# EAGLE board I2CRJ45X32 (EAGLE 9.6.2)
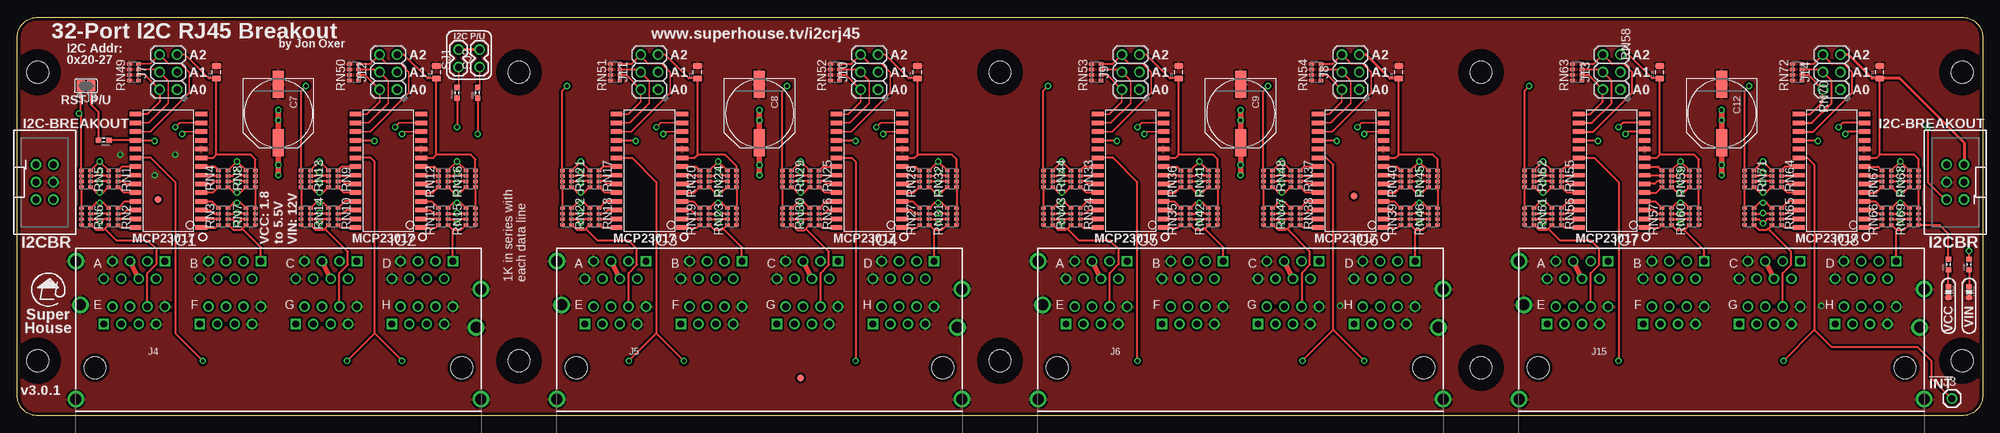
[diagram p10: board, top side]
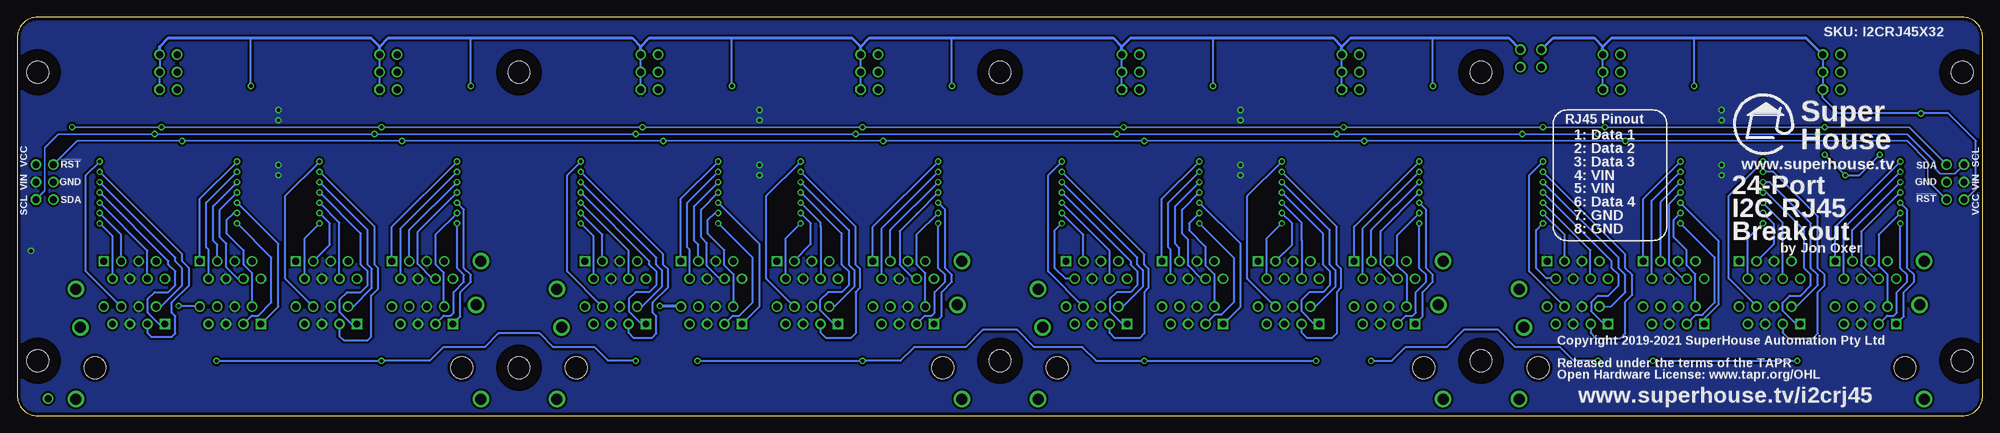
[diagram p11: board, bottom side, seen from below]

Size 286 x 58 mm. Coordinates in mm from the lower left corner, seen from the top.
Outline: 3,0 arc-90 0,3 0,55 arc-90 3,58 283,58 arc-90 286,55 286,3 arc-90 283,0 3,0
Copper layers (1*16): Top 0.035mm / dielectric 1.5mm / Bottom 0.035mm
Design rules "default *": minimum track width 10mil, minimum drill 0.5mm, track to track 12mil, track to pad 12mil, pad to pad 12mil, via to via 12mil, smd to smd 8mil, copper to edge 18mil, drill to drill 8mil, minimum pad ring 10mil, minimum via ring 8mil, stop-mask expansion 4mil, vias tented up to drill 25mil, thermal gap 10mil
Holes 3.2 mm at 143,8 143,50 73,8 73,50 3,8 283,8 213,50 3,50 213,7 283,50
tRestrict: area 69.8,4.8 to 76.2,11.2; area 139.8,4.8 to 146.2,11.2; area 139.8,46.8 to 146.2,53.2; area 69.8,46.8 to 76.2,53.2; area -0.2,4.8 to 6.2,11.2; area 279.8,4.8 to 286.2,11.2; area 279.8,46.8 to 286.2,53.2; area -0.2,46.8 to 6.2,53.2; area 209.8,3.8 to 216.2,10.2; area 209.8,46.8 to 216.2,53.2
bRestrict: area 69.8,46.8 to 76.2,53.2; area 139.8,46.8 to 146.2,53.2; area 69.8,4.8 to 76.2,11.2; area 139.8,4.8 to 146.2,11.2; area -0.2,4.8 to 6.2,11.2; area 279.8,4.8 to 286.2,11.2; area 279.8,46.8 to 286.2,53.2; area -0.2,46.8 to 6.2,53.2; area 209.8,3.8 to 216.2,10.2; area 209.8,46.8 to 216.2,53.2

## Footprints (pad centres in the part's own frame; a part is rotated, then mirrored left to right if it is on the bottom)
C0805 = smd 0.8 x 1.2: 1 -0.9,0; 2 0.9,0
PANASONIC_G = smd 3.9 x 1.6: + 4.25,0; - -4.25,0
FIDUCIAL-1X2.5 = smd 1 x 1: 1 0,0
SO28W = smd 0.65 x 1.7: 1 -7.62,-4.78; 2 -6.35,-4.78; 3 -5.08,-4.78; 4 -3.81,-4.78; 5 -2.54,-4.78; 6 -1.27,-4.78; 7 0,-4.78; 8 1.27,-4.78; 9 2.54,-4.78; 10 3.81,-4.78; 11 5.08,-4.78; 12 6.35,-4.78; 13 7.62,-4.78; 14 8.89,-4.78; 15 8.89,4.78; 16 7.62,4.78; 17 6.35,4.78; 18 5.08,4.78; 19 3.81,4.78; 20 2.54,4.78; 21 1.27,4.78; 22 0,4.78; 23 -1.27,4.78; 24 -2.54,4.78; 25 -3.81,4.78; 26 -5.08,4.78; 27 -6.35,4.78; 28 -7.62,4.78
2X3-2.54-SHROUDED = drill 1 octagon: 1 -2.54,-1.27 | drill 1: 2 -2.54,1.27; 3 0,-1.27; 4 0,1.27; 5 2.54,-1.27; 6 2.54,1.27
1X01 = drill 1.016: 1 0,0
RJ45-2X4 = drill 1 square: A1 -16.51,15.49; B1 -2.54,15.49; C1 11.43,15.49; D1 25.4,15.49; E1 -25.4,6.35; F1 -11.43,6.35; G1 2.54,6.35; H1 16.51,6.35 | drill 1: A2 -17.78,12.95; A3 -19.05,15.49; A4 -20.32,12.95; A5 -21.59,15.49; A6 -22.86,12.95; A7 -24.13,15.49; A8 -25.4,12.95; B2 -3.81,12.95; B3 -5.08,15.49; B4 -6.35,12.95; B5 -7.62,15.49; B6 -8.89,12.95; B7 -10.16,15.49; B8 -11.43,12.95; C2 10.16,12.95; C3 8.89,15.49; C4 7.62,12.95; C5 6.35,15.49; C6 5.08,12.95; C7 3.81,15.49; C8 2.54,12.95; D2 24.13,12.95; D3 22.86,15.49; D4 21.59,12.95; D5 20.32,15.49; D6 19.05,12.95; D7 17.78,15.49; D8 16.51,12.95; E2 -24.13,8.89; E3 -22.86,6.35; E4 -21.59,8.89; E5 -20.32,6.35; E6 -19.05,8.89; E7 -17.78,6.35; E8 -16.51,8.89; F2 -10.16,8.89; F3 -8.89,6.35; F4 -7.62,8.89; F5 -6.35,6.35; F6 -5.08,8.89; F7 -3.81,6.35; F8 -2.54,8.89; G2 3.81,8.89; G3 5.08,6.35; G4 6.35,8.89; G5 7.62,6.35; G6 8.89,8.89; G7 10.16,6.35; G8 11.43,8.89; H2 17.78,8.89; H3 19.05,6.35; H4 20.32,8.89; H5 21.59,6.35; H6 22.86,8.89; H7 24.13,6.35; H8 25.4,8.89 | drill 1.6: GND0 29.464,-4.572; GND1 28.79,5.85; GND2 -29.46,15.5; GND3 -28.79,9.15; GND4 -29.464,-4.572; GND5 29.46,11.43 | hole 3.2: 26.67,0; -26.67,0
2X03-P = drill 1.016 octagon: 1 -2.54,-1.27 | drill 1.016: 2 -2.54,1.27; 3 0,-1.27; 4 0,1.27; 5 2.54,-1.27; 6 2.54,1.27
LED-0603 = smd 0.762 x 0.762: A -0.762,0; C 0.762,0
R0603 = smd 0.762 x 0.762: 1 -0.762,0; 2 0.762,0
CAY16 = smd 0.5 x 0.65: 1 -1.2,-0.675; 2 -0.4,-0.675; 3 0.4,-0.675; 4 1.2,-0.675; 5 1.2,0.675; 6 0.4,0.675; 7 -0.4,0.675; 8 -1.2,0.675
1X02-P = drill 1.016: 1 -1.27,0; 2 1.27,0
SJ = smd 1.168 x 1.6: 1 -0.762,0; 2 0.762,0

## Placement (x,y rotation side)
C1  10uF  [C0805]  29,50 90 top
C2  10uF  [C0805]  61,50 90 top
C3  10uF  [C0805]  99,50 90 top
C4  10uF  [C0805]  131,50 90 top
C5  10uF  [C0805]  169,50 90 top
C6  10uF  [C0805]  201,50 90 top
C7  330uF 50V  [PANASONIC_G]  38,44 270 top
C8  330uF 50V  [PANASONIC_G]  108,44 270 top
C9  330uF 50V  [PANASONIC_G]  178,44 270 top
C10  10uF  [C0805]  239,50 90 top
C11  10uF  [C0805]  271,50 90 top
C12  330uF 50V  [PANASONIC_G]  248,44 270 top
FID1  FIDUCIAL1X2.5  [FIDUCIAL-1X2.5]  20.5,31.5 0 top
FID2  FIDUCIAL1X2.5  [FIDUCIAL-1X2.5]  194.5,32 0 top
FID3  FIDUCIAL1X2.5  [FIDUCIAL-1X2.5]  114,5.5 0 top
IC1  MCP23017SO  [SO28W]  22,35 90 top
IC2  MCP23017SO  [SO28W]  54,35 90 top
IC3  MCP23017SO  [SO28W]  92,35 90 top
IC4  MCP23017SO  [SO28W]  124,35 90 top
IC5  MCP23017SO  [SO28W]  162,35 90 top
IC6  MCP23017SO  [SO28W]  194,35 90 top
IC7  MCP23017SO  [SO28W]  232,35 90 top
IC8  MCP23017SO  [SO28W]  264,35 90 top
J1  I2C-BREAKOUT  [2X3-2.54-SHROUDED]  4,34 270 top
J2  I2C-BREAKOUT  [2X3-2.54-SHROUDED]  282,34 90 top
J3  M01-PLAIN  [1X01]  281.5,2.5 0 top
J4  RJ45-X8  [RJ45-2X4]  38,7 0 top
J5  RJ45-X8  [RJ45-2X4]  108,7 0 top
J6  RJ45-X8  [RJ45-2X4]  178,7 0 top
J7  I2C Addr 1  [2X03-P]  22,50 90 top
J8  I2C Addr 6  [2X03-P]  194,50 90 top
J9  I2C Addr 5  [2X03-P]  162,50 90 top
J10  I2C Addr 4  [2X03-P]  124,50 90 top
J11  I2C Addr 3  [2X03-P]  92,50 90 top
J12  I2C Addr 2  [2X03-P]  54,50 90 top
J13  I2C Addr 6  [2X03-P]  232,50 90 top
J14  I2C Addr 6  [2X03-P]  264,50 90 top
J15  RJ45-X8  [RJ45-2X4]  248,7 0 top
LED1  GREEN  [LED-0603]  284,18 270 top
LED2  BLUE  [LED-0603]  281,18 270 top
R97  4K7  [R0603]  281,22 90 top
R98  4K7  [R0603]  284,22 90 top
R99  4K7  [R0603]  67,47 90 top
R100  4K7  [R0603]  64,47 90 top
R101  10K  [R0603]  12.6,40.1 180 top
RN1  1K  [CAY16]  14,34.5 90 top
RN2  1K  [CAY16]  14,29 90 top
RN3  1K  [CAY16]  30,29 270 top
RN4  1K  [CAY16]  30,34.5 270 top
RN5  10K  [CAY16]  10,34.5 90 top
RN6  10K  [CAY16]  10,29 90 top
RN7  10K  [CAY16]  34,29 270 top
RN8  10K  [CAY16]  34,34.5 270 top
RN9  1K  [CAY16]  46,34.5 90 top
RN10  1K  [CAY16]  46,29 90 top
RN11  1K  [CAY16]  62,29 270 top
RN12  1K  [CAY16]  62,34.5 270 top
RN13  10K  [CAY16]  42,34.5 90 top
RN14  10K  [CAY16]  42,29 90 top
RN15  10K  [CAY16]  66,29 270 top
RN16  10K  [CAY16]  66,34.5 270 top
RN17  1K  [CAY16]  84,34.5 90 top
RN18  1K  [CAY16]  84,29 90 top
RN19  1K  [CAY16]  100,29 270 top
RN20  1K  [CAY16]  100,34.5 270 top
RN21  10K  [CAY16]  80,34.5 90 top
RN22  10K  [CAY16]  80,29 90 top
RN23  10K  [CAY16]  104,29 270 top
RN24  10K  [CAY16]  104,34.5 270 top
RN25  1K  [CAY16]  116,34.5 90 top
RN26  1K  [CAY16]  116,29 90 top
RN27  1K  [CAY16]  132,29 270 top
RN28  1K  [CAY16]  132,34.5 270 top
RN29  10K  [CAY16]  112,34.5 90 top
RN30  10K  [CAY16]  112,29 90 top
RN31  10K  [CAY16]  136,29 270 top
RN32  10K  [CAY16]  136,34.5 270 top
RN33  1K  [CAY16]  154,34.5 90 top
RN34  1K  [CAY16]  154,29 90 top
RN35  1K  [CAY16]  170,29 270 top
RN36  1K  [CAY16]  170,34.5 270 top
RN37  1K  [CAY16]  186,34.5 90 top
RN38  1K  [CAY16]  186,29 90 top
RN39  1K  [CAY16]  202,29 270 top
RN40  1K  [CAY16]  202,34.5 270 top
RN41  10K  [CAY16]  174,34.5 270 top
RN42  10K  [CAY16]  174,29 270 top
RN43  10K  [CAY16]  150,29 90 top
RN44  10K  [CAY16]  150,34.5 90 top
RN45  10K  [CAY16]  206,34.5 270 top
RN46  10K  [CAY16]  206,29 270 top
RN47  10K  [CAY16]  182,29 90 top
RN48  10K  [CAY16]  182,34.5 90 top
RN49  10K  [CAY16]  17,50 270 top
RN50  10K  [CAY16]  49,50 270 top
RN51  10K  [CAY16]  87,50 270 top
RN52  10K  [CAY16]  119,50 270 top
RN53  10K  [CAY16]  157,50 270 top
RN54  10K  [CAY16]  189,50 270 top
RN55  1K  [CAY16]  224,34.5 90 top
RN56  1K  [CAY16]  224,29 90 top
RN57  1K  [CAY16]  240,29 270 top
RN58  1K  [CAY16]  240,34.5 270 top
RN59  10K  [CAY16]  244,34.5 270 top
RN60  10K  [CAY16]  244,29 270 top
RN61  10K  [CAY16]  220,29 90 top
RN62  10K  [CAY16]  220,34.5 90 top
RN63  10K  [CAY16]  227,50 270 top
RN64  1K  [CAY16]  256,34.5 90 top
RN65  1K  [CAY16]  256,29 90 top
RN66  1K  [CAY16]  272,29 270 top
RN67  1K  [CAY16]  272,34.5 270 top
RN68  10K  [CAY16]  276,34.5 270 top
RN69  10K  [CAY16]  276,29 270 top
RN70  10K  [CAY16]  252,29 90 top
RN71  10K  [CAY16]  252,34.5 90 top
RN72  10K  [CAY16]  259,50 270 top
SJ1  SDA PU  [1X02-P]  64.23,52 90 top
SJ2  SCL PU  [1X02-P]  67.27,52 90 top
SJ3  RST-PU  [SJ]  10,48 180 top

## Tracks (layer width: path | path; a pad name or v marks a point on that pad's centre or on a via)
1A1  (via drill 0.5)
  Top 0.305: RN1.5 12.03,37 v12,37 11.97,37 RN5.4
  Bottom 0.305: v12,37 21.49,27.51 J4.A1
1A2  (via drill 0.5)
  Top 0.305: RN1.6 12.6,34.9 v12,35.5 11.4,34.9 RN5.3
  Bottom 0.305: v12,35.5 20.22,27.28 J4.A2
1A3  (via drill 0.5)
  Top 0.305: RN1.7 12.1,34.1 v12,34 11.9,34.1 RN5.2
  Bottom 0.254: J4.A3 19,22.54
  Bottom 0.305: v12,34 19,27 19,22.54
1A6  (via drill 0.5)
  Top 0.305: RN1.8 12.53,32.5 v12,32.5 11.47,32.5 RN5.1
  Bottom 0.305: v12,32.5 17.7,26.8 17.7,21.9 15.75,19.95 J4.A6
1B1
  Top 0.305: RN3.5 31.48,27 32.52,27 32.76,27.24 | RN7.4 32.76,27.24 | J4.B1 35.46,24.54 32.76,27.24
1B2  (via drill 0.5)
  Top 0.305: RN3.6 31.4,28.6 v32,28 32.6,28.6 RN7.3
  Bottom 0.305: J4.B2 34.19,25.81 v32,28
1B3  (via drill 0.5)
  Top 0.305: RN3.7 31.9,29.4 v32,29.5 32.1,29.4 RN7.2
  Bottom 0.305: v32,29.5 30.42,27.92 30.42,24.99 J4.B3
1B6  (via drill 0.5)
  Top 0.305: RN3.8 31.48,31 v32,31 32.52,31 RN7.1
  Bottom 0.305: J4.B6 29.11,28.11 v32,31
1C1  (via drill 0.5)
  Top 0.305: RN9.5 44.02,37 v44,37 43.98,37 RN13.4
  Bottom 0.305: v44,37 49.43,31.57 J4.C1
1C2  (via drill 0.5)
  Top 0.305: RN9.6 44.6,34.9 v44,35.5 43.4,34.9 RN13.3
  Bottom 0.254: J4.C2 48.18,19.97
  Bottom 0.305: v44,35.5 48.18,31.32 48.18,19.97
1C3  (via drill 0.5)
  Top 0.305: RN9.7 44.1,34.1 v44,34 43.9,34.1 RN13.2
  Bottom 0.305: J4.C3 46.89,31.11 v44,34
1C6  (via drill 0.5)
  Top 0.305: RN13.1 43.48,32.5 v44,32.5 44.52,32.5 RN9.8
  Bottom 0.305: J4.C6 43.69,19.95 45.61,21.87 45.61,30.89 v44,32.5
1D1
  Top 0.305: 63.48,27 RN11.5 | RN15.4 64.53,27 63.48,27 | J4.D1 63.4,26.93 63.48,27
1D2  (via drill 0.5)
  Top 0.305: RN11.6 63.4,28.6 v64,28 64.6,28.6 RN15.3
  Bottom 0.305: J4.D2 62.18,20 63.5,20 65,21.5 65,27 v64,28
1D3  (via drill 0.5)
  Top 0.305: RN15.2 64.1,29.4 v64,29.5 63.9,29.4 RN11.7
  Bottom 0.305: v64,29.5 60.86,26.36 J4.D3
1D6  (via drill 0.5)
  Top 0.305: RN15.1 64.53,31 v64,31 63.48,31 RN11.8
  Bottom 0.254: J4.D6 57.1,20
  Bottom 0.305: v64,31 57.1,24.1 57.1,20
1E1  (via drill 0.5)
  Top 0.305: RN2.5 12.53,31 v12,31 11.47,31 RN6.4
  Bottom 0.305: J4.E1 11.5,14.45 11.5,18 10,19.5 10,20.5 11,21.5 11,30 v12,31
1E2  (via drill 0.5)
  Top 0.305: RN2.6 12.1,29.4 v12,29.5 11.9,29.4 RN6.3
  Bottom 0.305: v12,29.5 15.16,26.34 15.16,21.86 13.87,20.57 J4.E2
1E3  (via drill 0.5)
  Top 0.305: RN2.7 12.6,28.6 v12,28 11.4,28.6 RN6.2
  Bottom 0.305: J4.E3 13.93,14.56 12.94,14.56 12.5,15 12.5,18 11,19.5 11,20.5 12,21.5 v12,28
1E6
  Top 0.305: RN6.1 11.47,27 12.53,27 12.76,27.24 | RN2.8 12.76,27.24 | J4.E6 18.95,20.78 20.28,22.11 20.28,24.22 19,25.5 14.5,25.5 12.76,27.24
1F1  (via drill 0.5)
  Top 0.305: RN4.5 31.48,32.5 v32,32.5 32.52,32.5 RN8.4
  Bottom 0.305: v32,32.5 31.5,32.5 26,27 26,21.5 25,20.5 25,19 26.5,17.5 28.1,17.5 29.13,16.47 29.13,15.3 27.18,13.35 J4.F1
1F2  (via drill 0.5)
  Top 0.305: RN4.6 31.9,34.1 v32,34 32.1,34.1 RN8.3
  Bottom 0.305: J4.F2 27.11,15.89 24,19 24,20.5 25,21.5 25,28 31,34 v32,34
1F3  (via drill 0.5)
  Top 0.305: RN4.7 31.4,34.9 v32,35.5 32.6,34.9 RN8.2
  Bottom 0.305: J4.F3 29.11,12.11 28.3,11.3 24.7,11.3 24,12 24,18 23,19 23,20.5 24,21.5 24,29 30.5,35.5 v32,35.5
1F6  (via drill 0.5)
  Top 0.305: RN4.8 31.98,37 v32,37 32.02,37 RN8.1
  Bottom 0.254: J4.F6 32.92,15.92
  Bottom 0.305: 32.92,15.92 37,20 37,32 v32,37
1G1  (via drill 0.5)
  Top 0.305: RN10.5 44.52,31 v44,31 43.48,31 RN14.4
  Bottom 0.305: J4.G1 40.54,14.1 38.39,16.25 38.39,25.39 v44,31
1G2  (via drill 0.5)
  Top 0.305: RN10.6 44.1,29.4 v44,29.5 43.9,29.4 RN14.3
  Bottom 0.305: J4.G2 41.81,20.61 43.1,21.9 43.1,24.1 45,26 45,28.5 v44,29.5
1G3  (via drill 0.5)
  Top 0.305: RN14.2 43.4,28.6 v44,28 44.6,28.6 RN10.7
  Bottom 0.305: J4.G3 41.75,14.68 40.82,14.68 39,16.5 39,23 v44,28
1G6
  Top 0.305: RN14.1 43.48,27 44.52,27 44.76,27.24 | RN10.8 44.76,27.24 | J4.G6 46.89,20.78 48.1,21.99 48.1,23.9 44.76,27.24
1H1  (via drill 0.5)
  Top 0.305: RN16.4 64.53,32.5 v64,32.5 63.48,32.5 RN12.5
  Bottom 0.305: J4.H1 55.12,13.35 57,15.23 57,16.5 56,17.5 54.5,17.5 53,19 53,20.5 54,21.5 54,22.5 v64,32.5
1H2  (via drill 0.5)
  Top 0.305: RN16.3 64.1,34.1 v64,34 63.9,34.1 RN12.6
  Bottom 0.254: J4.H2 54.11,15.89
  Bottom 0.305: 54.11,15.89 52,18 52,20.5 53,21.5 53,23 v64,34
1H3  (via drill 0.5)
  Top 0.305: RN16.2 64.6,34.9 v64,35.5 63.4,34.9 RN12.7
  Bottom 0.305: J4.H3 57.05,12.05 56.3,11.3 52.7,11.3 52,12 52,16.6 51,17.6 51,20.5 52,21.5 52,23.5 v64,35.5
1H6  (via drill 0.5)
  Top 0.305: RN12.8 63.98,37 v64,37 64.03,37 RN16.1
  Bottom 0.305: J4.H6 66,21.03 66,35 v64,37
2A1  (via drill 0.5)
  Top 0.305: RN17.5 82.03,37 v82,37 81.97,37 RN21.4
  Bottom 0.305: J5.A1 91.49,27.51 v82,37
2A2  (via drill 0.5)
  Top 0.305: RN17.6 82.6,34.9 v82,35.5 81.4,34.9 RN21.3
  Bottom 0.305: J5.A2 90.22,27.28 v82,35.5
2A3  (via drill 0.5)
  Top 0.305: RN17.7 82.1,34.1 v82,34 81.9,34.1 RN21.2
  Bottom 0.305: J5.A3 88.95,27.05 v82,34
2A6  (via drill 0.5)
  Top 0.305: RN21.1 81.47,32.5 v82,32.5 82.53,32.5 RN17.8
  Bottom 0.305: J5.A6 85.58,19.95 87.62,21.99 87.62,26.88 v82,32.5
2B1
  Top 0.305: RN19.5 101.47,27 102.53,27 102.76,27.24 | RN23.4 102.76,27.24 | J5.B1 105.46,24.54 102.76,27.24
2B2  (via drill 0.5)
  Top 0.305: RN19.6 101.4,28.6 v102,28 102.6,28.6 RN23.3
  Bottom 0.305: J5.B2 104.19,25.81 v102,28
2B3  (via drill 0.5)
  Top 0.305: RN23.2 102.1,29.4 v102,29.5 101.9,29.4 RN19.7
  Bottom 0.305: J5.B3 100.5,24.91 100.5,28 v102,29.5
2B6  (via drill 0.5)
  Top 0.305: RN19.8 101.47,31 v102,31 102.53,31 RN23.1
  Bottom 0.305: J5.B6 99.11,25.5 99.11,25.61 99.11,28.11 v102,31
2C1  (via drill 0.5)
  Top 0.305: RN25.5 114.03,37 v114,37 113.97,37 RN29.4
  Bottom 0.305: J5.C1 119.43,31.57 v114,37
2C2  (via drill 0.5)
  Top 0.305: RN29.3 113.4,34.9 v114,35.5 114.6,34.9 RN25.6
  Bottom 0.305: J5.C2 118.16,24.16 118.5,24.5 118.5,31 v114,35.5
2C3  (via drill 0.5)
  Top 0.305: RN25.7 114.1,34.1 v114,34 113.9,34.1 RN29.2
  Bottom 0.305: J5.C3 116.89,24.39 117.5,25 117.5,30.5 v114,34
2C6  (via drill 0.5)
  Top 0.305: RN29.1 113.47,32.5 v114,32.5 114.53,32.5 RN25.8
  Bottom 0.305: J5.C6 113.69,19.95 115.64,21.9 115.64,25.64 116.5,26.5 116.5,30 v114,32.5
2D1
  Top 0.305: 133.47,27 RN27.5 | RN31.4 134.53,27 133.47,27 | J5.D1 133.4,26.93 133.47,27
2D2  (via drill 0.5)
  Top 0.305: RN27.6 133.4,28.6 v134,28 134.6,28.6 RN31.3
  Bottom 0.305: J5.D2 133.45,19.95 135,21.5 135,27 v134,28
2D3  (via drill 0.5)
  Top 0.305: RN31.2 134.1,29.4 v134,29.5 133.9,29.4 RN27.7
  Bottom 0.305: J5.D3 130.86,26.36 v134,29.5
2D6  (via drill 0.5)
  Top 0.305: RN31.1 134.53,31 v134,31 133.47,31 RN27.8
  Bottom 0.305: v134,31 127.05,24.05 J5.D6
2E1  (via drill 0.5)
  Top 0.305: RN22.4 81.47,31 v82,31 82.53,31 RN18.5
  Bottom 0.305: J5.E1 81.5,14.45 81.5,18 80,19.5 80,20.5 81,21.5 81,30 v82,31
2E2  (via drill 0.5)
  Top 0.305: RN18.6 82.1,29.4 v82,29.5 81.9,29.4 RN22.3
  Bottom 0.254: J5.E2 83.85,15.91
  Bottom 0.305: 83.85,15.91 83.85,20.5 85.2,21.84 85.2,26.3 v82,29.5
2E3  (via drill 0.5)
  Top 0.305: RN18.7 82.6,28.6 v82,28 81.4,28.6 RN22.2
  Bottom 0.305: J5.E3 83.93,14.56 82.94,14.56 82.5,15 82.5,18 81,19.5 81,20.5 82,21.5 v82,28
2E6
  Top 0.305: RN22.1 81.47,27 82.53,27 82.76,27.24 | RN18.8 82.76,27.24 | J5.E6 88.95,20.78 90.16,21.99 90.16,24.34 89,25.5 84.5,25.5 82.76,27.24
2F1  (via drill 0.5)
  Top 0.305: RN24.4 102.53,32.5 v102,32.5 101.47,32.5 RN20.5
  Bottom 0.305: J5.F1 97.25,13.35 99.13,15.23 99.13,16.87 98,18 96,18 95,19 95,21 96,22 96,26.5 v102,32.5
2F2  (via drill 0.5)
  Top 0.305: RN24.3 102.1,34.1 v102,34 101.9,34.1 RN20.6
  Bottom 0.305: J5.F2 97.11,15.89 94.2,18.8 94.2,21.2 95,22 95,27 v102,34
2F3  (via drill 0.5)
  Top 0.305: RN24.2 102.6,34.9 v102,35.5 101.4,34.9 RN20.7
  Bottom 0.305: J5.F3 99.11,12.11 98.3,11.3 94.7,11.3 94,12 94,18 93.4,18.6 93.4,21.4 94,22 94,27.5 v102,35.5
2F6  (via drill 0.5)
  Top 0.305: RN24.1 102.03,37 v102,37 101.97,37 RN20.8
  Bottom 0.305: J5.F6 107,19.97 107,32 v102,37
2G1  (via drill 0.5)
  Top 0.305: RN26.5 114.53,31 v114,31 113.47,31 RN30.4
  Bottom 0.305: J5.G1 108,15.89 108,25 v114,31
2G2  (via drill 0.5)
  Top 0.305: RN26.6 114.1,29.4 v114,29.5 113.9,29.4 RN30.3
  Bottom 0.305: J5.G2 111.81,20.61 113.1,21.9 113.1,24.6 115.5,27 115.5,28 v114,29.5
2G3  (via drill 0.5)
  Top 0.305: RN26.7 114.6,28.6 v114,28 113.4,28.6 RN30.2
  Bottom 0.305: v114,28 109,23 109,16.5 110.82,14.68 111.75,14.68 J5.G3
2G6
  Top 0.305: RN30.1 113.47,27 114.53,27 114.76,27.24 | 114.76,27.24 RN26.8 | J5.G6 116.89,20.78 118.1,21.99 118.1,23.9 114.76,27.24
2H1  (via drill 0.5)
  Top 0.305: RN32.4 134.53,32.5 v134,32.5 133.47,32.5 RN28.5
  Bottom 0.305: J5.H1 125.12,13.35 127,15.23 127,17 126,18 124,18 123,19 123,21 124,22 124,22.5 v134,32.5
2H2  (via drill 0.5)
  Top 0.305: RN32.3 134.1,34.1 v134,34 133.9,34.1 RN28.6
  Bottom 0.254: 125.11,15.89 J5.H2
  Bottom 0.305: 125.11,15.89 122.2,18.8 122.2,21.2 123,22 123,23 v134,34
2H3  (via drill 0.5)
  Top 0.305: RN32.2 134.6,34.9 v134,35.5 133.4,34.9 RN28.7
  Bottom 0.305: J5.H3 127.05,12.05 126.3,11.3 122.7,11.3 122,12 122,18 121.4,18.6 121.4,21.4 122,22 122,23.5 v134,35.5
2H6  (via drill 0.5)
  Top 0.305: RN28.8 133.97,37 v134,37 134.03,37 RN32.1
  Bottom 0.305: J5.H6 136,21.03 136,35 v134,37
3A1  (via drill 0.5)
  Top 0.305: RN33.5 152.03,37 v152,37 151.97,37 RN44.4
  Bottom 0.305: v152,37 161.49,27.51 J6.A1
3A2  (via drill 0.5)
  Top 0.305: RN33.6 152.6,34.9 v152,35.5 151.4,34.9 RN44.3
  Bottom 0.305: v152,35.5 160.22,27.28 J6.A2
3A3  (via drill 0.5)
  Top 0.305: RN44.2 151.9,34.1 v152,34 152.1,34.1 RN33.7
  Bottom 0.305: v152,34 158.95,27.05 J6.A3
3A6  (via drill 0.5)
  Top 0.305: RN33.8 152.53,32.5 v152,32.5 151.47,32.5 RN44.1
  Bottom 0.305: v152,32.5 155,29.5 155.14,29.36 157.62,26.88 157.62,21.99 155.58,19.95 J6.A6
3B1
  Top 0.305: J6.B1 175.46,24.54 172.76,27.24 | RN35.5 171.47,27 172.53,27 172.76,27.24 | RN42.4 172.76,27.24
3B2  (via drill 0.5)
  Top 0.305: RN35.6 171.4,28.6 v172,28 172.6,28.6 RN42.3
  Bottom 0.305: J6.B2 174.19,25.81 v172,28
3B3  (via drill 0.5)
  Top 0.305: RN42.2 172.1,29.4 v172,29.5 171.9,29.4 RN35.7
  Bottom 0.305: J6.B3 172.92,22.58 170.5,25 170.5,28 v172,29.5
3B6  (via drill 0.5)
  Top 0.305: RN42.1 172.53,31 v172,31 171.47,31 RN35.8
  Bottom 0.305: J6.B6 169.11,27.5 169.11,27.61 169.11,28.11 v172,31
3C1  (via drill 0.5)
  Top 0.305: RN48.4 183.97,37 v184,37 184.03,37 RN37.5
  Bottom 0.305: J6.C1 189.43,31.57 v184,37
3C2  (via drill 0.5)
  Top 0.305: RN37.6 184.6,34.9 v184,35.5 183.4,34.9 RN48.3
  Bottom 0.305: J6.C2 188.16,24.16 188.5,24.5 188.5,31 v184,35.5
3C3  (via drill 0.5)
  Top 0.305: RN37.7 184.1,34.1 v184,34 183.9,34.1 RN48.2
  Bottom 0.305: J6.C3 186.89,24.89 187.5,25.5 187.5,30.5 v184,34
3C6  (via drill 0.5)
  Top 0.305: RN37.8 184.53,32.5 v184,32.5 183.47,32.5 RN48.1
  Bottom 0.305: J6.C6 183.74,19.95 185.64,21.84 185.64,25.14 186.5,26 186.5,30 v184,32.5
3D1
  Top 0.305: 203.47,27 RN39.5 | RN46.4 204.53,27 203.47,27 | J6.D1 203.4,26.93 203.47,27
3D2  (via drill 0.5)
  Top 0.305: RN46.3 204.6,28.6 v204,28 203.4,28.6 RN39.6
  Bottom 0.305: J6.D2 202.13,26.13 v204,28
3D3  (via drill 0.5)
  Top 0.305: RN46.2 204.1,29.4 v204,29.5 203.9,29.4 RN39.7
  Bottom 0.305: v204,29.5 200.86,26.36 J6.D3
3D6  (via drill 0.5)
  Top 0.305: RN46.1 204.53,31 v204,31 203.47,31 RN39.8
  Bottom 0.305: v204,31 197.05,24.05 J6.D6
3E1  (via drill 0.5)
  Top 0.305: RN34.5 152.53,31 v152,31 151.47,31 RN43.4
  Bottom 0.305: J6.E1 151.5,14.45 151.5,18 150,19.5 150,20.5 151,21.5 151,30 v152,31
3E2  (via drill 0.5)
  Top 0.305: RN34.6 152.1,29.4 v152,29.5 151.9,29.4 RN43.3
  Bottom 0.305: J6.E2 153.87,20.78 155.08,21.99 155.08,26.42 v152,29.5
3E3  (via drill 0.5)
  Top 0.305: RN34.7 152.6,28.6 v152,28 151.4,28.6 RN43.2
  Bottom 0.305: J6.E3 153.93,14.56 152.94,14.56 152.5,15 152.5,18 151,19.5 151,20.5 152,21.5 v152,28
3E6
  Top 0.305: RN43.1 151.47,27 152,27 152.53,27 152.76,27.24 | RN34.8 152.76,27.24 | J6.E6 158.95,20.78 160.28,22.11 160.28,24.22 159,25.5 154.5,25.5 152.76,27.24
3F1  (via drill 0.5)
  Top 0.305: RN36.5 171.47,32.5 v172,32.5 172.53,32.5 RN41.4
  Bottom 0.305: J6.F1 167.15,13.35 169.13,15.33 169.13,16.87 168,18 166,18 165,19 165,21 166,22 166,26.5 v172,32.5
3F2  (via drill 0.5)
  Top 0.305: RN41.3 172.1,34.1 v172,34 171.9,34.1 RN36.6
  Bottom 0.305: J6.F2 167.11,15.89 164.2,18.8 164.2,21.2 165,22 165,27 v172,34
3F3  (via drill 0.5)
  Top 0.305: RN41.2 172.6,34.9 v172,35.5 171.4,34.9 RN36.7
  Bottom 0.305: J6.F3 169.11,12.11 168.3,11.3 164.7,11.3 164,12 164,18 163.4,18.6 163.4,21.4 164,22 164,27.5 v172,35.5
3F6  (via drill 0.5)
  Top 0.305: RN41.1 172.03,37 v172,37 171.97,37 RN36.8
  Bottom 0.305: J6.F6 177,19.97 177,32 v172,37
3G1  (via drill 0.5)
  Top 0.305: RN38.5 184.53,31 v184,31 183.47,31 RN47.4
  Bottom 0.305: v184,31 178,25 178,15.89 J6.G1
3G2  (via drill 0.5)
  Top 0.305: RN38.6 184.1,29.4 v184,29.5 183.9,29.4 RN47.3
  Bottom 0.305: J6.G2 181.81,20.61 183.1,21.9 183.1,24.1 185.5,26.5 185.5,28.5 184.5,29.5 v184,29.5
3G3  (via drill 0.5)
  Top 0.305: RN38.7 184.6,28.6 v184,28 183.4,28.6 RN47.2
  Bottom 0.305: v184,28 179,23 179,16.5 180.94,14.56 181.87,14.56 J6.G3
3G6
  Top 0.305: J6.G6 186.95,15.95 186.95,20.84 188.1,21.99 188.1,23.9 184.76,27.24 | RN47.1 183.47,27 184.53,27 184.76,27.24 | RN38.8 184.76,27.24
3H1  (via drill 0.5)
  Top 0.305: RN45.4 204.53,32.5 v204,32.5 203.47,32.5 RN40.5
  Bottom 0.305: J6.H1 195.15,13.35 197,15.2 197,17 196,18 194,18 193,19 193,21 194,22 194,22.5 v204,32.5
3H2  (via drill 0.5)
  Top 0.305: RN45.3 204.1,34.1 v204,34 203.9,34.1 RN40.6
  Bottom 0.254: 195.11,15.89 J6.H2
  Bottom 0.305: 195.11,15.89 192.2,18.8 192.2,21.2 193,22 193,23 v204,34
3H3  (via drill 0.5)
  Top 0.305: RN40.7 203.4,34.9 v204,35.5 204.6,34.9 RN45.2
  Bottom 0.305: J6.H3 197.05,12.05 196.3,11.3 193.7,11.3 193,12 193,14.5 193.5,15 193.5,16.5 191.3,18.7 191.3,21.3 192,22 192,23.5 v204,35.5
3H6  (via drill 0.5)
  Top 0.305: RN45.1 204.03,37 v204,37 203.97,37 RN40.8
  Bottom 0.305: J6.H6 206,21.03 206,35 v204,37
4A1  (via drill 0.5)
  Top 0.305: RN55.5 223.3,35.7 v222,37 221.97,37 RN62.4
  Bottom 0.305: J15.A1 231.49,27.51 v222,37
4A2  (via drill 0.5)
  Top 0.305: RN55.6 222.6,34.9 v222,35.5 221.4,34.9 RN62.3
  Bottom 0.305: J15.A2 230.22,27.28 v222,35.5
4A3  (via drill 0.5)
  Top 0.305: RN55.7 222.1,34.1 v222,34 221.9,34.1 RN62.2
  Bottom 0.305: J15.A3 228.95,27.05 v222,34
4A6  (via drill 0.5)
  Top 0.305: RN55.8 222.53,32.5 v222,32.5 221.47,32.5 RN62.1
  Bottom 0.305: J15.A6 225.58,19.95 227.74,22.11 227.74,26.76 v222,32.5
4B1
  Top 0.305: RN57.5 241.47,27 242.53,27 | RN60.4 242.53,27 | J15.B1 245.46,24.07 242.53,27
4B2  (via drill 0.5)
  Top 0.305: RN57.6 241.4,28.6 v242,28 242.6,28.6 RN60.3
  Bottom 0.305: J15.B2 244.19,25.81 v242,28
4B3  (via drill 0.5)
  Top 0.305: RN57.7 241.9,29.4 v242,29.5 242.1,29.4 RN60.2
  Bottom 0.305: J15.B3 240.5,24.91 240.5,28 v242,29.5
4B6  (via drill 0.5)
  Top 0.305: RN57.8 241.47,31 v242,31 242.53,31 RN60.1
  Bottom 0.305: J15.B6 239.11,28.11 v242,31
4C1  (via drill 0.5)
  Top 0.305: RN71.4 253.97,37 v254,37 254.03,37 RN64.5
  Bottom 0.305: J15.C1 259.43,31.57 v254,37
4C2  (via drill 0.5)
  Top 0.305: RN71.3 253.4,34.9 v254,35.5 254.6,34.9 RN64.6
  Bottom 0.305: J15.C2 258.16,24.16 258.5,24.5 258.5,31 v254,35.5
4C3  (via drill 0.5)
  Top 0.305: RN71.2 253.9,34.1 v254,34 254.1,34.1 RN64.7
  Bottom 0.305: J15.C3 256.89,24.89 257.5,25.5 257.5,30.5 v254,34
4C6  (via drill 0.5)
  Top 0.305: RN64.8 254.53,32.5 v254,32.5 253.47,32.5 RN71.1
  Bottom 0.305: J15.C6 253.91,19.95 255.56,21.6 255.56,25.06 256.5,26 256.5,30 255.56,30.94 255.5,31 v254,32.5
4D1
  Top 0.305: RN69.4 274.52,27 273.48,27 | 273.48,27 RN66.5 | J15.D1 273.4,26.93 273.48,27
4D2  (via drill 0.5)
  Top 0.305: RN66.6 273.4,28.6 v274,28 274.6,28.6 RN69.3
  Bottom 0.305: J15.D2 272.13,26.13 v274,28
4D3  (via drill 0.5)
  Top 0.305: RN66.7 273.9,29.4 v274,29.5 274.1,29.4 RN69.2
  Bottom 0.305: J15.D3 270.86,26.36 v274,29.5
4D6  (via drill 0.5)
  Top 0.305: RN66.8 273.48,31 v274,31 274.52,31 RN69.1
  Bottom 0.305: J15.D6 267.05,24.05 v274,31
4E1  (via drill 0.5)
  Top 0.305: RN56.5 222.53,31 v222,31 221.47,31 RN61.4
  Bottom 0.305: J15.E1 221.5,14.45 221.5,18 220,19.5 220,20.5 221,21.5 221,30 v222,31
4E2  (via drill 0.5)
  Top 0.305: RN61.3 221.9,29.4 v222,29.5 222.1,29.4 RN56.6
  Bottom 0.305: J15.E2 223.93,15.95 223.93,20.84 225.08,21.99 225.08,26.42 v222,29.5
4E3  (via drill 0.5)
  Top 0.305: RN56.7 222.6,28.6 v222,28 221.4,28.6 RN61.2
  Bottom 0.305: J15.E3 223.94,14.56 222.94,14.56 222.5,15 222.5,18 221,19.5 221,20.5 222,21.5 v222,28
4E6
  Top 0.305: RN56.8 222.76,27.24 | 222.76,27.24 222.53,27 221.47,27 RN61.1 | J15.E6 228.95,20.78 230.16,21.99 230.16,24.34 229,25.5 224.5,25.5 222.76,27.24
4F1  (via drill 0.5)
  Top 0.305: RN59.4 242.53,32.5 v242,32.5 241.47,32.5 RN58.5
  Bottom 0.305: J15.F1 237.35,13.35 239.05,15.05 239.05,16.95 238,18 236,18 235,19 235,21 236,22 236,26.5 v242,32.5
4F2  (via drill 0.5)
  Top 0.305: RN58.6 241.9,34.1 v242,34 242.1,34.1 RN59.3
  Bottom 0.305: J15.F2 237.11,15.89 234.39,18.61 234.39,21.39 235,22 235,27 v242,34
4F3  (via drill 0.5)
  Top 0.305: RN58.7 241.4,34.9 v242,35.5 242.6,34.9 RN59.2
  Bottom 0.305: J15.F3 239.11,11.61 238.5,11 235,11 234.5,11.5 234.5,17.5 233.5,18.5 233.5,21.5 234,22 234,27.5 v242,35.5
4F6  (via drill 0.5)
  Top 0.305: RN58.8 241.97,37 v242,37 242.03,37 RN59.1
  Bottom 0.305: J15.F6 247,19.97 247,32 v242,37
4G1  (via drill 0.5)
  Top 0.305: RN70.4 253.47,31 v254,31 254.53,31 RN65.5
  Bottom 0.305: J15.G1 248,15.89 248,25 v254,31
4G2  (via drill 0.5)
  Top 0.305: RN70.3 253.9,29.4 v254,29.5 254.1,29.4 RN65.6
  Bottom 0.305: J15.G2 251.81,20.78 253.02,21.99 253.02,24.02 255.5,26.5 255.5,28.5 254.5,29.5 v254,29.5
4G3  (via drill 0.5)
  Top 0.305: RN70.2 253.4,28.6 v254,28 254.6,28.6 RN65.7
  Bottom 0.305: J15.G3 251.87,14.56 250.94,14.56 249,16.5 249,23 v254,28
4G6
  Top 0.305: RN65.8 254.76,27.24 | 254.76,27.24 254.53,27 253.47,27 RN70.1 | J15.G6 256.89,20.78 258.1,21.99 258.1,23.9 254.76,27.24
4H1  (via drill 0.5)
  Top 0.305: RN68.4 274.52,32.5 v274,32.5 273.48,32.5 RN67.5
  Bottom 0.305: J15.H1 265.34,13.35 267,15.01 267,17 266,18 264,18 263,19 263,21 264,22 264,22.5 v274,32.5
4H2  (via drill 0.5)
  Top 0.305: RN68.3 274.1,34.1 v274,34 273.9,34.1 RN67.6
  Bottom 0.305: J15.H2 265.11,15.89 262,19 262,21.5 263,22.5 263,23 v274,34
4H3  (via drill 0.5)
  Top 0.305: RN68.2 274.6,34.9 v274,35.5 273.4,34.9 RN67.7
  Bottom 0.305: J15.H3 267.05,12.05 266.5,11.5 263.5,11.5 263,12 263,14.5 263.5,15 263.5,16.5 261,19 261,21.5 262,22.5 262,23.5 v274,35.5
4H6  (via drill 0.5)
  Top 0.305: RN67.8 273.98,37 v274,37 274.02,37 RN68.1
  Bottom 0.305: J15.H6 276,21.03 276,35 v274,37
!INT  (via drill 0.5)
  Top 0.305: IC1.20 19.46,37.54 23,34 23,12 v27,8 | IC2.20 51.46,37.54 52,37 52,12 | IC4.20 121.46,37.54 122,37 v122,8 | IC3.20 89.46,37.54 93,34 93,12 | v163,8 163,34 159.46,37.54 IC5.20 | 191.5,12.5 191.5,36.5 190.46,37.54 IC6.20 | 191.5,12.5 v187,8 | 93,12 v97,8 | v48,8 52,12 | J3.1 278.5,5.5 278.5,8 276.5,10 264,10 261.5,12.5 | 52,12 v56,8 | 93,12 v89,8 | IC7.20 229.46,37.54 233,34 v233,8 | IC8.20 260.46,37.54 261.5,36.5 261.5,12.5 | 261.5,12.5 v257,8 | 191.5,12.5 v196,8
  Bottom 0.305: v187,8 v163,8 157.5,8 155.5,10 148,10 145.5,12.5 140.5,12.5 138,10 131,10 129,8 v122,8 v97,8 | v48,8 v27,8 | v56,8 59.5,8 61.5,10 68,10 70.5,12.5 75.5,12.5 78,10 84,10 86,8 v89,8 | v257,8 v233,8 226,8 224,10 218,10 216,12 210,12 208,10 202,10 200,8 v196,8
!RESET  (via drill 0.5)
  Top 0.254: 189.3,40 IC6.18 | 157.3,40 IC5.18 | 119.3,40 IC4.18 | 87.3,40 IC3.18 | 17.3,40 IC1.18
  Top 0.305: v192,40 189.3,40 | v160,40 157.3,40 | v122,40 119.3,40 | v90,40 87.3,40 | v52,40 49.3,40 IC2.18 | v20,40 17.3,40 | IC1.18 13.38,40.08 R101.1 | v262,40 259.3,40 IC8.18 | v230,40 227.3,40 IC7.18
  Bottom 0.254: J1.6 8,34.19 8,37 11,40 v20,40 v52,40 v90,40 v122,40 v160,40 v192,40 v230,40 v262,40 277.27,40 J2.6
GND  (via drill 0.5)
  Bottom 0.305: v23,38 v20,35 18,35 v15,38 | v262.5,16 259.54,16 J15.G8
  Bottom 0.406: v192.5,16 189.54,16 J6.G8
  pour Top: 283,0 arc90 286,3 286,55 arc90 283,58 3,58 arc90 0,55 0,3 arc90 3,0
GPA0-1
  Top 0.305: IC1.21 15.24,36.27 RN1.4
GPA0-2
  Top 0.305: IC2.21 47.24,36.27 RN9.4
GPA0-3
  Top 0.305: IC3.21 85.25,36.27 RN17.4
GPA0-4
  Top 0.305: RN25.4 117.25,36.27 IC4.21
GPA0-5
  Top 0.305: IC5.21 155.25,36.27 RN33.4
GPA0-6
  Top 0.305: IC6.21 187.25,36.27 RN37.4
GPA0-7
  Top 0.305: IC7.21 225.25,36.27 RN55.4
GPA0-8
  Top 0.305: IC8.21 257.25,36.27 RN64.4
GPA1-1
  Top 0.305: IC1.22 17.12,34.9 RN1.3
GPA1-2
  Top 0.305: IC2.22 49.12,34.9 RN9.3
GPA1-3
  Top 0.305: RN17.3 87.12,34.9 IC3.22
GPA1-4
  Top 0.305: IC4.22 119.12,34.9 RN25.3
GPA1-5
  Top 0.305: RN33.3 157.12,34.9 IC5.22
GPA1-6
  Top 0.305: RN37.3 189.12,34.9 IC6.22
GPA1-7
  Top 0.305: RN55.3 227.12,34.9 IC7.22
GPA1-8
  Top 0.305: RN64.3 259.12,34.9 IC8.22
GPA2-1
  Top 0.305: RN1.2 15.4,34.1 15.77,33.73 IC1.23
GPA2-2
  Top 0.305: IC2.23 47.77,33.73 47.4,34.1 RN9.2
GPA2-3
  Top 0.305: IC3.23 85.77,33.73 85.4,34.1 RN17.2
GPA2-4
  Top 0.305: IC4.23 117.77,33.73 117.4,34.1 RN25.2
GPA2-5
  Top 0.305: IC5.23 155.77,33.73 155.4,34.1 RN33.2
GPA2-6
  Top 0.305: IC6.23 187.77,33.73 187.4,34.1 RN37.2
GPA2-7
  Top 0.305: RN55.2 225.4,34.1 225.77,33.73 IC7.23
GPA2-8
  Top 0.305: RN64.2 257.4,34.1 257.77,33.73 IC8.23
GPA3-1
  Top 0.305: IC1.24 15.52,32.46 RN1.1
GPA3-2
  Top 0.305: IC2.24 47.52,32.46 RN9.1
GPA3-3
  Top 0.305: IC3.24 85.52,32.46 RN17.1
GPA3-4
  Top 0.305: IC4.24 117.52,32.46 RN25.1
GPA3-5
  Top 0.305: IC5.24 155.51,32.46 RN33.1
GPA3-6
  Top 0.305: IC6.24 187.51,32.46 RN37.1
GPA3-7
  Top 0.305: IC7.24 225.51,32.46 RN55.1
GPA3-8
  Top 0.305: IC8.24 257.51,32.46 RN64.1
GPA4-1
  Top 0.305: RN2.4 15.66,31.19 IC1.25
GPA4-2
  Top 0.305: IC2.25 47.66,31.19 RN10.4
GPA4-3
  Top 0.305: IC3.25 85.67,31.19 RN18.4
GPA4-4
  Top 0.305: RN26.4 117.67,31.19 IC4.25
GPA4-5
  Top 0.305: IC5.25 155.66,31.19 RN34.4
GPA4-6
  Top 0.305: IC6.25 187.66,31.19 RN38.4
GPA4-7
  Top 0.305: IC7.25 225.66,31.19 RN56.4
GPA4-8
  Top 0.305: IC8.25 257.67,31.19 RN65.4
GPA5-1
  Top 0.305: IC1.26 15.92,29.92 15.4,29.4 RN2.3
GPA5-2
  Top 0.305: IC2.26 47.92,29.92 47.4,29.4 RN10.3
GPA5-3
  Top 0.305: IC3.26 85.92,29.92 85.4,29.4 RN18.3
GPA5-4
  Top 0.305: RN26.3 117.4,29.4 117.92,29.92 IC4.26
GPA5-5
  Top 0.305: IC5.26 155.92,29.92 155.4,29.4 RN34.3
GPA5-6
  Top 0.305: IC6.26 187.92,29.92 187.4,29.4 RN38.3
GPA5-7
  Top 0.305: RN56.3 225.4,29.4 225.92,29.92 IC7.26
GPA5-8
  Top 0.305: RN65.3 257.4,29.4 257.92,29.92 IC8.26
GPA6-1
  Top 0.305: IC1.27 17.17,28.6 RN2.2
GPA6-2
  Top 0.305: RN10.2 49.17,28.6 IC2.27
GPA6-3
  Top 0.305: RN18.2 87.17,28.6 IC3.27
GPA6-4
  Top 0.305: RN26.2 119.17,28.6 IC4.27
GPA6-5
  Top 0.305: IC5.27 157.17,28.6 RN34.2
GPA6-6
  Top 0.305: IC6.27 189.17,28.6 RN38.2
GPA6-7
  Top 0.305: RN56.2 227.17,28.6 IC7.27
GPA6-8
  Top 0.305: IC8.27 259.17,28.6 RN65.2
GPA7-1
  Top 0.305: IC1.28 15.1,27.38 RN2.1
GPA7-2
  Top 0.305: IC2.28 47.09,27.38 RN10.1
GPA7-3
  Top 0.305: IC3.28 85.09,27.38 RN18.1
GPA7-4
  Top 0.305: RN26.1 117.09,27.38 IC4.28
GPA7-5
  Top 0.305: RN34.1 155.09,27.38 IC5.28
GPA7-6
  Top 0.305: IC6.28 187.09,27.38 RN38.1
GPA7-7
  Top 0.305: IC7.28 225.09,27.38 RN56.1
GPA7-8
  Top 0.305: IC8.28 257.1,27.38 RN65.1
GPB0-1
  Top 0.305: IC1.1 28.91,27.38 RN3.4
GPB0-2
  Top 0.305: IC2.1 60.91,27.38 RN11.4
GPB0-3
  Top 0.305: IC3.1 98.91,27.38 RN19.4
GPB0-4
  Top 0.305: IC4.1 130.91,27.38 RN27.4
GPB0-5
  Top 0.305: IC5.1 168.91,27.38 RN35.4
GPB0-6
  Top 0.305: IC6.1 200.91,27.38 RN39.4
GPB0-7
  Top 0.305: IC7.1 238.91,27.38 RN57.4
GPB0-8
  Top 0.305: IC8.1 270.9,27.38 RN66.4
GPB1-1
  Top 0.305: RN3.3 26.83,28.6 IC1.2
GPB1-2
  Top 0.305: RN11.3 61.27,28.65 IC2.2
GPB1-3
  Top 0.305: RN19.3 96.83,28.6 IC3.2
GPB1-4
  Top 0.305: RN27.3 128.83,28.6 IC4.2
GPB1-5
  Top 0.305: RN35.3 166.83,28.6 IC5.2
GPB1-6
  Top 0.305: RN39.3 198.83,28.6 IC6.2
GPB1-7
  Top 0.305: RN57.3 236.83,28.6 IC7.2
GPB1-8
  Top 0.305: IC8.2 268.83,28.6 RN66.3
GPB2-1
  Top 0.305: IC1.3 28.08,29.92 28.6,29.4 RN3.2
GPB2-2
  Top 0.305: IC2.3 60.08,29.92 60.6,29.4 RN11.2
GPB2-3
  Top 0.305: RN19.2 98.6,29.4 98.08,29.92 IC3.3
GPB2-4
  Top 0.305: RN27.2 130.6,29.4 130.08,29.92 IC4.3
GPB2-5
  Top 0.305: IC5.3 168.08,29.92 168.6,29.4 RN35.2
GPB2-6
  Top 0.305: IC6.3 200.08,29.92 200.6,29.4 RN39.2
GPB2-7
  Top 0.305: RN57.2 238.6,29.4 238.08,29.92 IC7.3
GPB2-8
  Top 0.305: RN66.2 270.6,29.4 270.08,29.92 IC8.3
GPB3-1
  Top 0.305: IC1.4 28.34,31.19 RN3.1
GPB3-2
  Top 0.305: IC2.4 60.34,31.19 RN11.1
GPB3-3
  Top 0.305: IC3.4 98.33,31.19 RN19.1
GPB3-4
  Top 0.305: IC4.4 130.34,31.19 RN27.1
GPB3-5
  Top 0.305: IC5.4 168.34,31.19 RN35.1
GPB3-6
  Top 0.305: IC6.4 200.34,31.19 RN39.1
GPB3-7
  Top 0.305: IC7.4 238.34,31.19 RN57.1
GPB3-8
  Top 0.305: IC8.4 270.33,31.19 RN66.1
GPB4-1
  Top 0.305: RN4.4 28.48,32.46 IC1.5
GPB4-2
  Top 0.305: IC2.5 60.48,32.46 RN12.4
GPB4-3
  Top 0.305: IC3.5 98.48,32.46 RN20.4
GPB4-4
  Top 0.305: IC4.5 130.49,32.46 RN28.4
GPB4-5
  Top 0.305: IC5.5 168.49,32.46 RN36.4
GPB4-6
  Top 0.305: IC6.5 200.49,32.46 RN40.4
GPB4-7
  Top 0.305: IC7.5 238.49,32.46 RN58.4
GPB4-8
  Top 0.305: IC8.5 270.49,32.46 RN67.4
GPB5-1
  Top 0.305: IC1.6 28.23,33.73 28.6,34.1 RN4.3
GPB5-2
  Top 0.305: IC2.6 60.23,33.73 60.6,34.1 RN12.3
GPB5-3
  Top 0.305: IC3.6 98.23,33.73 98.6,34.1 RN20.3
GPB5-4
  Top 0.305: IC4.6 130.23,33.73 130.6,34.1 RN28.3
GPB5-5
  Top 0.305: IC5.6 168.23,33.73 168.6,34.1 RN36.3
GPB5-6
  Top 0.305: IC6.6 200.23,33.73 200.6,34.1 RN40.3
GPB5-7
  Top 0.305: RN58.3 238.6,34.1 238.23,33.73 IC7.6
GPB5-8
  Top 0.305: RN67.3 270.6,34.1 270.23,33.73 IC8.6
GPB6-1
  Top 0.305: IC1.7 26.88,34.9 RN4.2
GPB6-2
  Top 0.305: RN12.2 58.88,34.9 IC2.7
GPB6-3
  Top 0.305: IC3.7 96.88,34.9 RN20.2
GPB6-4
  Top 0.305: IC4.7 128.88,34.9 RN28.2
GPB6-5
  Top 0.305: RN36.2 166.88,34.9 IC5.7
GPB6-6
  Top 0.305: RN40.2 198.88,34.9 IC6.7
GPB6-7
  Top 0.305: RN58.2 236.88,34.9 IC7.7
GPB6-8
  Top 0.305: IC8.7 268.88,34.9 RN67.2
GPB7-1
  Top 0.305: RN4.1 28.75,36.27 IC1.8
GPB7-2
  Top 0.305: IC2.8 60.76,36.27 RN12.1
GPB7-3
  Top 0.305: RN20.1 98.75,36.27 IC3.8
GPB7-4
  Top 0.305: IC4.8 130.75,36.27 RN28.1
GPB7-5
  Top 0.305: IC5.8 168.75,36.27 RN36.1
GPB7-6
  Top 0.305: RN40.1 200.75,36.27 IC6.8
GPB7-7
  Top 0.305: IC7.8 238.75,36.27 RN58.1
GPB7-8
  Top 0.305: IC8.8 270.75,36.27 RN67.1
N$1
  Top 0.254: R99.2 67.27,48.03 SJ2.1
N$2
  Top 0.254: R100.2 64.23,47.99 SJ1.1
N$3
  Top 0.305: R101.2 11.84,44.16 10.76,45.24 SJ3.1
N$4
  Top 0.254: RN49.8 19.39,51.2 J7.6 22.08,51.19 23.81,51.19 25,50 25,47 19.35,41.35 IC1.17
N$5
  Top 0.254: RN49.7 20.33,50.4 J7.4 22,48.73 22,45.5 19.12,42.62 IC1.16
N$6
  Top 0.254: J7.2 18.59,49.6 RN49.6
  Top 0.305: J7.2 20.73,45.73 18.89,43.89 IC1.15
N$7
  Top 0.305: LED2.A R97.1
N$8
  Top 0.305: R98.1 LED1.A
N$9
  Top 0.254: J12.2 52.73,45.73 50.89,43.89 IC2.15
  Top 0.305: RN50.6 50.59,49.6 J12.2
N$10
  Top 0.254: IC2.16 51.12,42.62 54,45.5 54,48.73 J12.4
  Top 0.305: RN50.7 52.33,50.4 J12.4
N$11
  Top 0.254: IC2.17 51.35,41.35 57,47 57,49.98 55.79,51.19 53.81,51.19 52.59,52.41
  Top 0.305: RN50.8 51.39,51.2 52.59,52.41 J12.6
N$12
  Top 0.254: IC3.17 89.35,41.35 95,47 95,49.98 93.79,51.19 91.81,51.19 90.59,52.41
  Top 0.305: RN51.8 89.39,51.2 90.59,52.41 J11.6
N$13
  Top 0.254: IC3.15 88.89,43.89 90.73,45.73 J11.2
  Top 0.305: RN51.6 88.59,49.6 J11.2
N$14
  Top 0.254: IC3.16 89.12,42.62 92,45.5 92,48.73 J11.4
  Top 0.305: RN51.7 90.33,50.4 J11.4
N$15
  Top 0.254: IC4.17 121.35,41.35 127,47 127,49.98 125.79,51.19 124.08,51.19 J10.6
  Top 0.305: RN52.8 121.39,51.2 J10.6
N$16
  Top 0.254: IC4.15 120.89,43.89 122.73,45.73 J10.2
  Top 0.305: RN52.6 120.59,49.6 J10.2
N$17
  Top 0.254: IC4.16 121.12,42.62 124,45.5 124,48.73 J10.4
  Top 0.305: RN52.7 122.33,50.4 J10.4
N$18
  Top 0.254: IC5.17 159.35,41.35 165,47 165,49.98 163.79,51.19 161.81,51.19 160.59,52.41
  Top 0.305: RN53.8 159.39,51.2 160.59,52.41 J9.6
N$19
  Top 0.254: IC5.15 158.89,43.89 160.73,45.73 J9.2
  Top 0.305: RN53.6 158.59,49.6 J9.2
N$20
  Top 0.254: IC5.16 159.12,42.62 162,45.5 162,48.73 J9.4
  Top 0.305: RN53.7 160.33,50.4 J9.4
N$21
  Top 0.254: IC6.17 191.35,41.35 197,47 197,50 195.81,51.19 194.08,51.19 J8.6
  Top 0.305: RN54.8 191.39,51.2 J8.6
N$22
  Top 0.254: IC6.15 190.89,43.89 192.73,45.73 J8.2
  Top 0.305: RN54.6 190.59,49.6 J8.2
N$23
  Top 0.254: IC6.16 191.12,42.62 194,45.5 194,48.73 J8.4
  Top 0.305: RN54.7 192.33,50.4 J8.4
N$24
  Top 0.305: RN63.8 229.39,51.2 J13.6 232.05,51.22 233.78,51.22 235,50 235,47 229.35,41.35 IC7.17
N$25
  Top 0.305: RN63.6 228.59,49.6 J13.2 230.73,45.73 228.89,43.89 IC7.15
N$26
  Top 0.305: RN63.7 230.33,50.4 J13.4 232,48.73 232,45.5 229.12,42.62 IC7.16
N$27
  Top 0.305: RN72.8 261.39,51.2 J14.6 264.05,51.22 265.78,51.22 267,50 267,47 261.35,41.35 IC8.17
N$28
  Top 0.305: RN72.6 260.59,49.6 J14.2 262.73,45.73 260.89,43.89 IC8.15
N$29
  Top 0.305: RN72.7 262.33,50.4 J14.4 264,48.73 264,45.5 261.12,42.62 IC8.16
SCL  (via drill 0.5)
  Top 0.254: IC6.12 196.35,41.35 v196,41 | IC5.12 164.35,41.35 v164,41 | IC4.12 126.35,41.35 v126,41 | IC3.12 94.35,41.35 v94,41 | IC2.12 56.35,41.35 v56,41 | IC1.12 24.35,41.35 v24,41
  Top 0.305: R99.1 v67,41 | IC8.12 266.35,41.35 v266,41 | IC7.12 234.35,41.35 v234,41
  Bottom 0.254: J2.1 282,32.73 282,39 280,41 v266,41 v234,41 v196,41 v164,41 v126,41 v94,41 v67,41 v56,41 v24,41 11,41 7,37 7,36 6.19,35.19 4.08,35.19 J1.1
SDA  (via drill 0.5)
  Top 0.254: IC6.13 195.62,42.62 v195,42 | IC5.13 163.62,42.62 v163,42 | IC4.13 125.62,42.62 v125,42 | IC3.13 93.62,42.62 v93,42 | IC2.13 55.62,42.62 v55,42 | IC1.13 23.62,42.62 v23,42
  Top 0.305: R100.1 v64,42 | 280.54,31.46 278,34 v278,42 | IC8.13 265.62,42.62 v265,42 | IC7.13 233.62,42.62 v233,42
  Top 0.406: J2.2 280.54,31.46
  Bottom 0.254: v278,42 v265,42 v233,42 v195,42 v163,42 v125,42 v93,42 v64,42 v55,42 v23,42 10.73,42 J1.2
VCC  (via drill 0.5)
  Top 0.305: RN6.8 RN6.7 RN6.6 RN6.5 RN5.8 RN5.7 RN5.6 RN5.5 9.32,43.67 v9,44 9.24,44.24 SJ3.2 | RN7.5 RN7.6 RN7.7 RN7.8 RN8.5 RN8.6 RN8.7 RN8.8 34.67,37.33 34,38 29,38 | RN15.5 RN15.6 RN15.7 RN15.8 RN16.5 RN16.6 RN16.7 RN16.8 66.67,37.33 66,38 61,38 | RN22.8 RN22.7 RN22.6 RN22.5 RN21.8 RN21.7 RN21.6 RN21.5 79.33,47.33 v80,48 | RN23.5 RN23.6 RN23.7 RN23.8 RN24.5 RN24.6 RN24.7 RN24.8 104.67,36.33 103,38 99,38 | RN30.8 RN30.7 RN30.6 RN30.5 RN29.8 RN29.7 RN29.6 RN29.5 111.33,47.33 v112,48 | RN14.8 RN14.7 RN14.6 RN14.5 RN13.8 RN13.7 RN13.6 RN13.5 41.33,47.33 v42,48 | RN31.5 RN31.6 RN31.7 RN31.8 RN32.5 RN32.6 RN32.7 RN32.8 136.68,37.33 136,38 131,38 | RN46.5 RN46.6 RN46.7 RN46.8 RN45.5 RN45.6 RN45.7 RN45.8 206.68,37.33 206,38 201,38 | RN42.5 RN42.6 RN42.7 RN42.8 RN41.5 RN41.6 RN41.7 RN41.8 174.68,37.33 174,38 169,38 | RN43.8 RN43.7 RN43.6 RN43.5 RN44.8 RN44.7 RN44.6 RN44.5 149.32,47.33 v150,48 | RN47.8 RN47.7 RN47.6 RN47.5 RN48.8 RN48.7 RN48.6 RN48.5 181.32,47.33 v182,48 | R97.2 281,26.5 279.75,27.75 276.73,27.75 RN69.5 RN69.6 RN69.7 RN69.8 RN68.5 RN68.6 RN68.7 RN68.8 276.68,37.33 276,38 271,38 | IC1.9 28.54,37.54 29,38 | 29,38 C1.1 27.9,49.1 24.46,52.54 J7.5 | IC2.9 60.54,37.54 61,38 | 61,38 C2.1 59.71,49.1 56.27,52.54 J12.5 | IC4.9 130.54,37.54 131,38 | IC3.9 98.54,37.54 99,38 | 99,38 C3.1 97.71,49.1 94.27,52.54 J11.5 | 131,38 C4.1 129.71,49.1 126.27,52.54 J10.5 | IC5.9 168.54,37.54 169,38 | 169,38 C5.1 167.71,49.1 164.27,52.54 J9.5 | IC6.9 200.54,37.54 201,38 | 201,38 C6.1 | RN70.8 RN70.7 RN70.6 RN70.5 RN71.8 RN71.7 RN71.6 RN71.5 251.32,47.33 v252,48 | RN60.5 RN60.6 RN60.7 RN60.8 RN59.5 RN59.6 RN59.7 RN59.8 244.68,37.33 244,38 239,38
  Top 0.305: RN61.8 RN61.7 RN61.6 RN61.5 RN62.8 RN62.7 RN62.6 RN62.5 219.32,47.33 v220,48 | J13.5 234.46,52.54 237.9,49.1 C10.1 239,38 | IC7.9 238.54,37.54 239,38 | IC8.9 270.54,37.54 271,38 | 271,38 C11.1
  Top 0.406: SJ2.2 SJ1.2 | C6.1 199.71,49.1 196.27,52.54 J8.5 | J2.5 283.27,39.73 273.9,49.1 C11.1 269.9,49.1 266.46,52.54 J14.5
  Bottom 0.305: J7.5 J7.3 J7.1 23.27,46.27 21,44 v9,44 5,44 1,40 1,33 2.54,31.46 J1.5 | J9.1 J9.3 J9.5 | J10.1 J10.3 J10.5 | J11.1 J11.3 J11.5 | J12.1 J12.3 J12.5 | J8.1 J8.3 J8.5 | v42,48 42,55 | v112,48 112,55 | v182,48 182,55 | v80,48 80,55 | v150,48 150,55 | J13.1 J13.3 J13.5 | J14.1 J14.3 J14.5 | v252,48 252,55 | v220,48 220,55
  Bottom 0.406: J8.5 195.27,53.73 | 195.27,53.73 194,55 182,55 164.54,55 163.27,53.73 | J9.5 163.27,53.73 | 163.27,53.73 162,55 150,55 126.54,55 125.27,53.73 | J10.5 125.27,53.73 | 125.27,53.73 124,55 112,55 94.54,55 93.27,53.73 | J11.5 93.27,53.73 | 93.27,53.73 92,55 80,55 69,55 SJ2.2 | SJ1.2 62.5,55 56.54,55 55.27,53.73 | J12.5 55.27,53.73 | 55.27,53.73 54,55 42,55 25.73,55 J7.5 | J13.5 233.27,53.73 | 233.27,53.73 232,55 220,55 196.54,55 195.27,53.73 | J14.5 265.27,53.73 264,55 252,55 234.54,55 233.27,53.73
VIN  (via drill 0.5)
  Top 0.305: R98.2 v284,24
  Top 0.813: v108,35 v108,36.5 C8.+ v108,43 v108,44.5 | v38,35 v38,36.5 C7.+ v38,43 v38,44.5 | J4.A5 J4.A4 | J4.C5 J4.C4 | J6.C5 J6.C4 | J6.A5 J6.A4 | J5.C5 J5.C4 | J5.A5 J5.A4 | v178,35 v178,36.5 C9.+ v178,43 v178,44.5 | v248,35 v248,36.5 C12.+ v248,43 v248,44.5 | J15.A4 J15.A5 | J15.C4 J15.C5
  pour Bottom: 283,0 arc90 286,3 286,55 arc90 283,58 3,58 arc90 0,55 0,3 arc90 3,0

## Text on the board
tPlace: 32-Port I2C RJ45 Breakout | I2C P/U | www.superhouse.tv/i2crj45 | by Jon Oxer | A2 | A2 | A2 | A2 | A2 | A2 | A2 | A2 | I2C Addr: / 0x20-27 | A1 | A1 | A1 | A1 | A1 | A1 | A1 | A1 | A0 | A0 | A0 | A0 | A0 | A0 | A0 | A0 | RST P/U | I2C-BREAKOUT | I2C-BREAKOUT | I2CBR | MCP23017 | VCC: 1.8 / to 5.5V / VIN: 12V | MCP23017 | MCP23017 | MCP23017 | MCP23017 | MCP23017 | MCP23017 | MCP23017 | I2CBR | 1K in series with / each data line | VCC | VIN | Super / House | !INT | v3.0.1
bPlace: SKU: I2CRJ45X32 | Super / House | RJ45 Pinout | !RST | SCL | SDA | www.superhouse.tv | VCC | VIN | GND | GND | VIN | !RST | SDA | VCC | SCL | 24-Port / I2C RJ45 / Breakout | 1: Data 1 / 2: Data 2 / 3: Data 3 / 4: VIN / 5: VIN / 6: Data 4 / 7: GND / 8: GND | by Jon Oxer | Copyright 2019-2021 SuperHouse Automation Pty Ltd / / Released under the terms of the TAPR / Open Hardware License: www.tapr.org/OHL | www.superhouse.tv/i2crj45